# EAGLE schematic hycomBridge(Beginner)V6 (EAGLE 9.4.1)
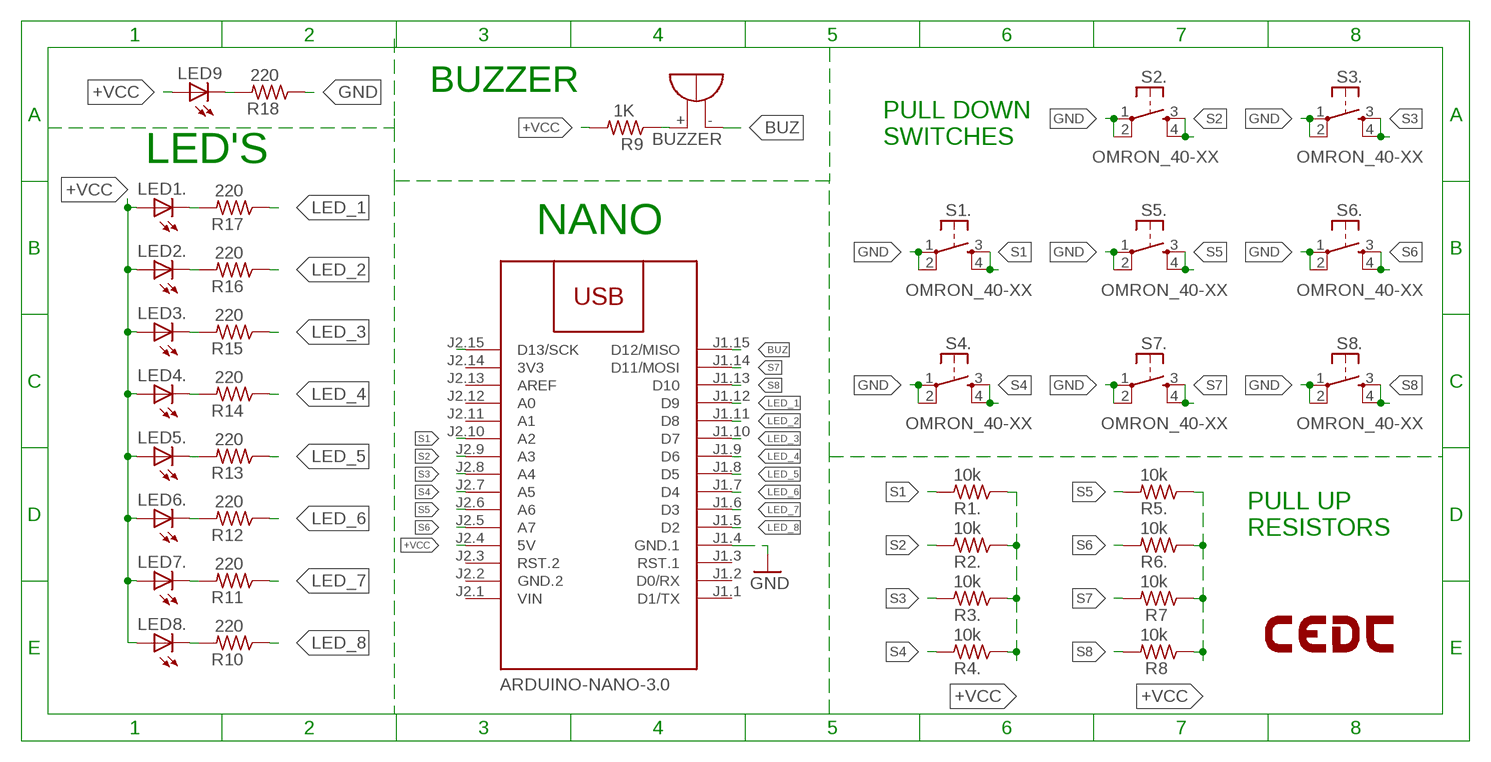
[diagram p0: schematic, sheet 1]

## Parts
ARDUINO_NANO  ARDUINO-NANO-3.0  [ARDUINO-NANO-3.0]
LED1.  LED5MM  [LED5MM]
LED2.  LED5MM  [LED5MM]
LED3.  LED5MM  [LED5MM]
LED4.  LED5MM  [LED5MM]
LED5.  LED5MM  [LED5MM]
LED6.  LED5MM  [LED5MM]
LED7.  LED5MM  [LED5MM]
LED8.  LED5MM  [LED5MM]
LED9  LED3MM  [LED3MM]
LOGO1  LOGO-CEDTBOT-18MM  [LOGO-CEDT-BOT-18MM]
LOGO2  LOGO-CEDTSILK-18MM  [LOGO-CEDT-SILK-18MM]
R1.  10k  RESISTOR0207/10  [0207/10]
R2.  10k  RESISTOR0207/10  [0207/10]
R3.  10k  RESISTOR0207/10  [0207/10]
R4.  10k  RESISTOR0207/10  [0207/10]
R5.  10k  RESISTOR0207/10  [0207/10]
R6.  10k  RESISTOR0207/10  [0207/10]
R7  10k  RESISTOR0207/10  [0207/10]
R8  10k  RESISTOR0207/10  [0207/10]
R9  1K  RESISTOR0207/10  [0207/10]
R10  220  RESISTOR0207/10  [0207/10]
R11  220  RESISTOR0207/10  [0207/10]
R12  220  RESISTOR0207/10  [0207/10]
R13  220  RESISTOR0207/10  [0207/10]
R14  220  RESISTOR0207/10  [0207/10]
R15  220  RESISTOR0207/10  [0207/10]
R16  220  RESISTOR0207/10  [0207/10]
R17  220  RESISTOR0207/10  [0207/10]
R18  220  RESISTOR0207/10  [0207/10]
S1.  OMRON_40-XX  OMRON_SWITCH_40-XX  [B3F-40XX]
S2.  OMRON_40-XX  OMRON_SWITCH_40-XX  [B3F-40XX]
S3.  OMRON_40-XX  OMRON_SWITCH_40-XX  [B3F-40XX]
S4.  OMRON_40-XX  OMRON_SWITCH_40-XX  [B3F-40XX]
S5.  OMRON_40-XX  OMRON_SWITCH_40-XX  [B3F-40XX]
S6.  OMRON_40-XX  OMRON_SWITCH_40-XX  [B3F-40XX]
S7.  OMRON_40-XX  OMRON_SWITCH_40-XX  [B3F-40XX]
S8.  OMRON_40-XX  OMRON_SWITCH_40-XX  [B3F-40XX]
SG1  BUZZER  [F/TMB]

## Nets
+VCC: ARDUINO_NANO.J2.4(5V) LED1..A LED2..A LED3..A LED4..A LED5..A LED6..A LED7..A LED8..A LED9.A R1..1 R2..1 R3..1 R4..1 R5..1 R6..1 R7.1 R8.1 R9.2
.: R9.1 SG1.+
BUZ: ARDUINO_NANO.J1.15(D12/MISO) SG1.-
GND: ARDUINO_NANO.J1.4(GND.1) R18.1 S1..1(P) S1..2(P1) S2..1(P) S2..2(P1) S3..1(P) S3..2(P1) S4..1(P) S4..2(P1) S5..1(P) S5..2(P1) S6..1(P) S6..2(P1) S7..1(P) S7..2(P1) S8..1(P) S8..2(P1)
LED_1: ARDUINO_NANO.J1.12(D9) R17.1
LED_2: ARDUINO_NANO.J1.11(D8) R16.1
LED_3: ARDUINO_NANO.J1.10(D7) R15.1
LED_4: ARDUINO_NANO.J1.9(D6) R14.1
LED_5: ARDUINO_NANO.J1.8(D5) R13.1
LED_6: ARDUINO_NANO.J1.7(D4) R12.1
LED_7: ARDUINO_NANO.J1.6(D3) R11.1
LED_8: ARDUINO_NANO.J1.5(D2) R10.1
N$1: LED7..K(C) R11.2
N$2: LED6..K(C) R12.2
N$3: LED2..K(C) R16.2
N$4: LED1..K(C) R17.2
N$5: LED5..K(C) R13.2
N$6: LED4..K(C) R14.2
N$7: LED8..K(C) R10.2
N$9: LED3..K(C) R15.2
N$16: LED9.K(C) R18.2
N$36: ARDUINO_NANO.J2.15(D13/SCK)
S1: ARDUINO_NANO.J2.10(A2) R1..2 S1..3(S) S1..4(S1)
S2: ARDUINO_NANO.J2.9(A3) R2..2 S2..3(S) S2..4(S1)
S3: ARDUINO_NANO.J2.8(A4) R3..2 S3..3(S) S3..4(S1)
S4: ARDUINO_NANO.J2.7(A5) R4..2 S4..3(S) S4..4(S1)
S5: ARDUINO_NANO.J2.6(A6) R5..2 S5..3(S) S5..4(S1)
S6: ARDUINO_NANO.J2.5(A7) R6..2 S6..3(S) S6..4(S1)
S7: ARDUINO_NANO.J1.14(D11/MOSI) R7.2 S7..3(S) S7..4(S1)
S8: ARDUINO_NANO.J1.13(D10) R8.2 S8..3(S) S8..4(S1)
Unconnected: ARDUINO_NANO.J1.1(D1/TX) ARDUINO_NANO.J1.2(D0/RX) ARDUINO_NANO.J1.3(RST.1) ARDUINO_NANO.J2.3(RST.2) ARDUINO_NANO.J2.11(A1) ARDUINO_NANO.J2.12(A0) ARDUINO_NANO.J2.13(AREF)

## Notes on the sheet
- BUZZER
- PULL DOWN
  SWITCHES
- LED'S
- NANO
- PULL UP
  RESISTORS

## Power pins joined to a net without a drawn wire
3V3: ARDUINO_NANO.J2.14(3V3)
GND.2: ARDUINO_NANO.J2.2(GND.2)
VIN: ARDUINO_NANO.J2.1(VIN)

## Library data of the parts
ARDUINO_NANO = diy-modules:ARDUINO-NANO-3.0: Arduino Nano 3.0 and compatible devices More details available here: https://www.arduino.cc/en/Main/ArduinoBoardNano Click here to find device on ebay.com <http://www.ebay.com/sch/arduino+nano>
LED1. LED2. LED3. LED4. LED5. LED6. LED7. LED8. LED9 = adafruit:LED: LED OSRAM: - CHIPLED LG R971, LG N971, LY N971, LG Q971, LY Q971, LO R971, LY R971 LH N974, LH R974 LS Q976, LO Q976, LY Q976 LO Q996 - Hyper CHIPLED LW Q18S LB Q993, LB Q99A, LB R99A - SideLED LS A670, LO A670, LY A670, LG A670, LP A670 LB A673, LV A673, LT A673, LW A673 LH A674 LY A675 LS A676, LA A676, LO A676, LY A676, LW A676 LS A679, LY A679, LG A679 - Hyper Micro SIDELED® LS Y876, LA Y876, LO Y876, LY Y876 LT Y87S - SmartLED LW L88C, LW L88S LB L89C, LB L89S, LG L890 LS L89K, LO L89K, LY L89K LS L896, LA L896, LO L896, LY L896 - TOPLED LS T670, LO T670, LY T670, LG T670, LP T670 LSG T670, LSP T670, LSY T670, LOP T670, LYG T670 LG T671, LOG T671, LSG T671 LB T673, LV T673, LT T673, LW T673 LH T674 LS T676, LA T676, LO T676, LY T676, LB T676, LH T676, LSB T676, LW T676 LB T67C, LV T67C, LT T67C, LS T67K, LO T67K, LY T67K, LW E67C LS E67B, LA E67B, LO E67B, LY E67B, LB E67C, LV E67C, LT E67C LW T67C LS T679, LY T679, LG T679 LS T770, LO T770, LY T770, LG T770, LP T770 LB T773, LV T773, LT T773, LW T773 LH T774 LS E675, LA E675, LY E675, LS T675 LS T776, LA T776, LO T776, LY T776, LB T776 LHGB T686 LT T68C, LB T68C - Hyper Mini TOPLED® LB M676 - Mini TOPLED Santana® LG M470 LS M47K, LO M47K, LY M47K Source: http://www.osram.convergy.de/
LOGO1 LOGO2 = CEDT_JANUARY_2015_v5:LOGO-CEDT
R1. R2. R3. R4. R5. R6. R7-R18 = CEDT_JANUARY_2015_v5 (2):RESISTOR
S1. S2. S3. S4. S5. S6. S7. S8. = CEDT_JANUARY_2015_v5 (2):OMRON_SWITCH
SG1 = CEDT_JANUARY_2015_v5 (2):BUZZER: BUZZER Source: Buerklin; OC_FARNELL: unknown; OC_NEWARK: unknown